# Altium schematic sheet Sheet.01.SchDoc
size A4
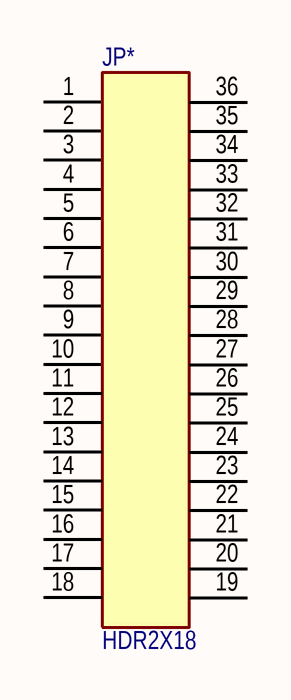
[diagram p0: Sheet.01.SchDoc]

## Parts
JP*  HDR2X18  [HDR2X18]

## Nets

Not connected (* = marked no-connect by the designer): JP* 1 2 3 4 5 6 7 8 9 10 11 12 13 14 15 16 17 18 19 20 21 22 23 24 25 26 27 28 29 30 31 32 33 34 35 36